# EAGLE schematic uart (EAGLE 7.3.0)
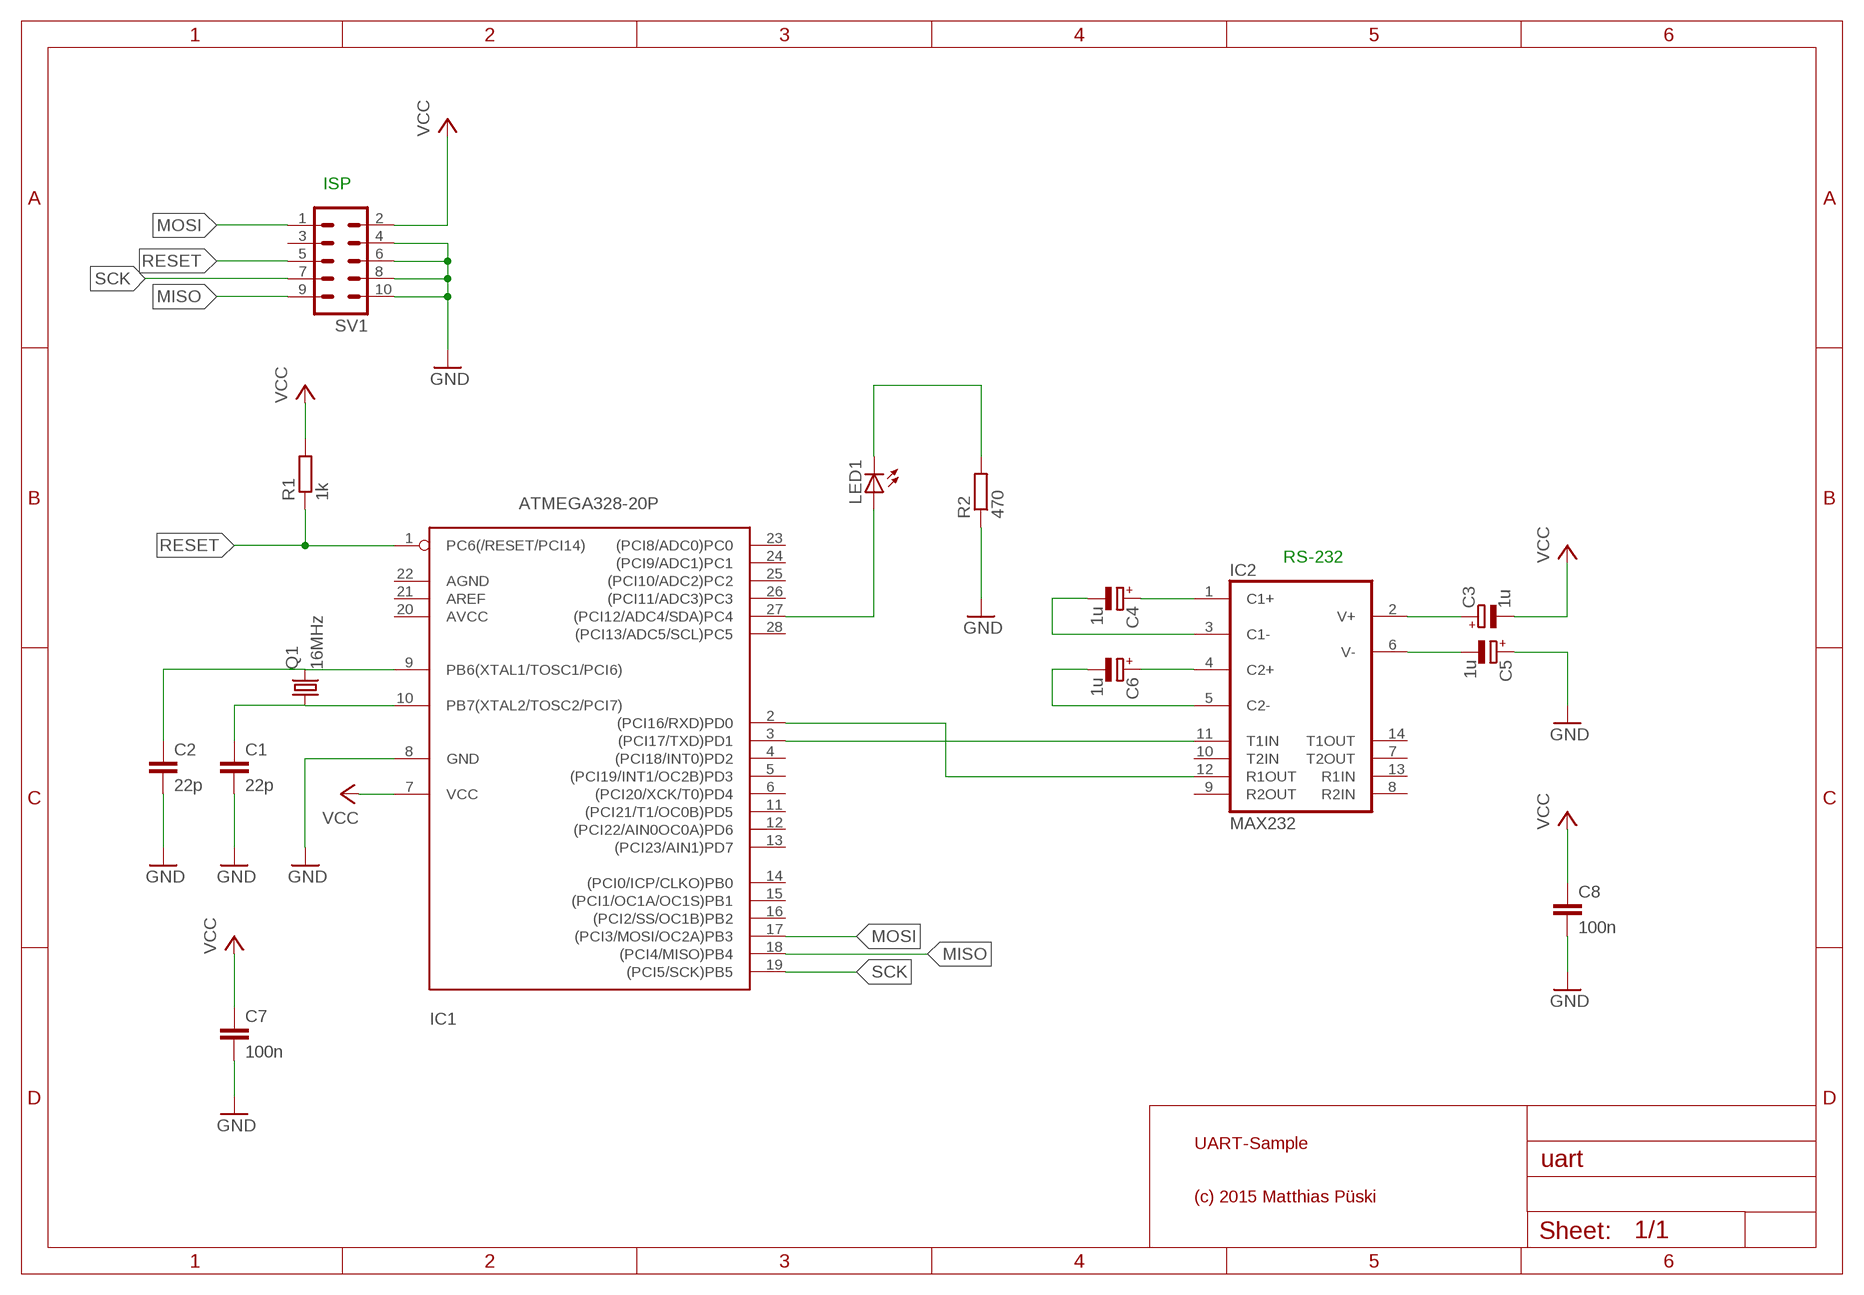
[diagram p0: schematic, sheet 1]

## Parts
C1  22p  C-EU025-024X044  [C025-024X044]
C2  22p  C-EU025-024X044  [C025-024X044]
C3  1u  CPOL-EUE2.5-5  [E2,5-5]
C4  1u  CPOL-EUE2.5-5  [E2,5-5]
C5  1u  CPOL-EUE2.5-5  [E2,5-5]
C6  1u  CPOL-EUE2.5-5  [E2,5-5]
C7  100n  C-EU025-024X044  [C025-024X044]
C8  100n  C-EU025-024X044  [C025-024X044]
IC1  ATMEGA328-20P  [DIL28-3]
IC2  MAX232  [DIL16]
LED1  LED5MM  [LED5MM]
Q1  16MHz  CRYSTALHC49U-V  [HC49U-V]
R1  1k  R-EU_0204/7  [0204/7]
R2  470  R-EU_0204/7  [0204/7]
SV1  ML10  [ML10]

## Nets
GND: C1.2 C2.2 C5.+ C7.2 C8.2 IC1.8(GND) R2.1 SV1.4 SV1.6 SV1.8 SV1.10
MISO: IC1.18((PCI4/MISO)PB4) SV1.9
MOSI: IC1.17((PCI3/MOSI/OC2A)PB3) SV1.1
N$2: C2.1 IC1.9(PB6(XTAL1/TOSC1/PCI6)) Q1.2
N$3: C1.1 IC1.10(PB7(XTAL2/TOSC2/PCI7)) Q1.1
N$4: C4.+ IC2.1(C1+)
N$5: C4.- IC2.3(C1-)
N$6: C3.+ IC2.2(V+)
N$7: C5.- IC2.6(V-)
N$8: C6.+ IC2.4(C2+)
N$9: C6.- IC2.5(C2-)
N$10: IC1.3((PCI17/TXD)PD1) IC2.11(T1IN)
N$11: IC1.2((PCI16/RXD)PD0) IC2.12(R1OUT)
N$12: IC1.27((PCI12/ADC4/SDA)PC4) LED1.A
N$13: LED1.K(C) R2.2
RESET: IC1.1(PC6(/RESET/PCI14)) R1.1 SV1.5
SCK: IC1.19((PCI5/SCK)PB5) SV1.7
VCC: C3.- C7.1 C8.1 IC1.7(VCC) R1.2 SV1.2
Unconnected: IC1.4((PCI18/INT0)PD2) IC1.5((PCI19/INT1/OC2B)PD3) IC1.6((PCI20/XCK/T0)PD4) IC1.11((PCI21/T1/OC0B)PD5) IC1.12((PCI22/AIN0OC0A)PD6) IC1.13((PCI23/AIN1)PD7) IC1.14((PCI0/ICP/CLKO)PB0) IC1.15((PCI1/OC1A/OC1S)PB1) IC1.16((PCI2/SS/OC1B)PB2) IC1.20(AVCC) IC1.21(AREF) IC1.22(AGND) IC1.23((PCI8/ADC0)PC0) IC1.24((PCI9/ADC1)PC1) IC1.25((PCI10/ADC2)PC2) IC1.26((PCI11/ADC3)PC3) IC1.28((PCI13/ADC5/SCL)PC5) IC2.7(T2OUT) IC2.8(R2IN) IC2.9(R2OUT) IC2.10(T2IN) IC2.13(R1IN) IC2.14(T1OUT) SV1.3

## Notes on the sheet
- ISP
- RS-232
- UART-Sample
- (c) 2015 Matthias Püski

## Power pins joined to a net without a drawn wire
GND: IC2.15(GND)
VCC: IC2.16(VCC)

## Library data of the parts
C1 C2 C7 C8 = rcl:C-EU: CAPACITOR, European symbol
C3-C6 = rcl:CPOL-EU: POLARIZED CAPACITOR, European symbol
IC1 = atmega328:ATMEGA328*P: MICROCONTROLLER 32 kBytes FLASH 2 kBytes SRAM 1 kBytes EEPROM USART 8-channel 10 bit ADC
IC2 = maxim:MAX232: RS232 TRANSCEIVER; MF: MAXIM; MPN: MAX232ACPE+; OC_FARNELL: 9723773; OC_NEWARK: 68K4544
LED1 = led:LED: LED OSRAM: - CHIPLED LG R971, LG N971, LY N971, LG Q971, LY Q971, LO R971, LY R971 LH N974, LH R974 LS Q976, LO Q976, LY Q976 LO Q996 - Hyper CHIPLED LW Q18S LB Q993, LB Q99A, LB R99A - SideLED LS A670, LO A670, LY A670, LG A670, LP A670 LB A673, LV A673, LT A673, LW A673 LH A674 LY A675 LS A676, LA A676, LO A676, LY A676, LW A676 LS A679, LY A679, LG A679 - Hyper Micro SIDELED® LS Y876, LA Y876, LO Y876, LY Y876 LT Y87S - SmartLED LW L88C, LW L88S LB L89C, LB L89S, LG L890 LS L89K, LO L89K, LY L89K LS L896, LA L896, LO L896, LY L896 - TOPLED LS T670, LO T670, LY T670, LG T670, LP T670 LSG T670, LSP T670, LSY T670, LOP T670, LYG T670 LG T671, LOG T671, LSG T671 LB T673, LV T673, LT T673, LW T673 LH T674 LS T676, LA T676, LO T676, LY T676, LB T676, LH T676, LSB T676, LW T676 LB T67C, LV T67C, LT T67C, LS T67K, LO T67K, LY T67K, LW E67C LS E67B, LA E67B, LO E67B, LY E67B, LB E67C, LV E67C, LT E67C LW T67C LS T679, LY T679, LG T679 LS T770, LO T770, LY T770, LG T770, LP T770 LB T773, LV T773, LT T773, LW T773 LH T774 LS E675, LA E675, LY E675, LS T675 LS T776, LA T776, LO T776, LY T776, LB T776 LHGB T686 LT T68C, LB T68C - Hyper Mini TOPLED® LB M676 - Mini TOPLED Santana® LG M470 LS M47K, LO M47K, LY M47K Source: http://www.osram.convergy.de LUXEON: - LUMILED® LXK2-PW12-R00, LXK2-PW12-S00, LXK2-PW14-U00, LXK2-PW14-V00 LXK2-PM12-R00, LXK2-PM12-S00, LXK2-PM14-U00 LXK2-PE12-Q00, LXK2-PE12-R00, LXK2-PE12-S00, LXK2-PE14-T00, LXK2-PE14-U00 LXK2-PB12-K00, LXK2-PB12-L00, LXK2-PB12-M00, LXK2-PB14-N00, LXK2-PB14-P00, LXK2-PB14-Q00 LXK2-PR12-L00, LXK2-PR12-M00, LXK2-PR14-Q00, LXK2-PR14-R00 LXK2-PD12-Q00, LXK2-PD12-R00, LXK2-PD12-S00 LXK2-PH12-R00, LXK2-PH12-S00 LXK2-PL12-P00, LXK2-PL12-Q00, LXK2-PL12-R00 Source: www.luxeon.com KINGBRIGHT: KA-3528ASYC Source: www.kingbright.com
Q1 = crystal:CRYSTAL: CRYSTAL; OC_FARNELL: 1666969; OC_NEWARK: unknown
R1 R2 = rcl:R-EU_: RESISTOR, European symbol
SV1 = con-harting-ml:ML10: HARTING; OC_FARNELL: unknown; OC_NEWARK: unknown